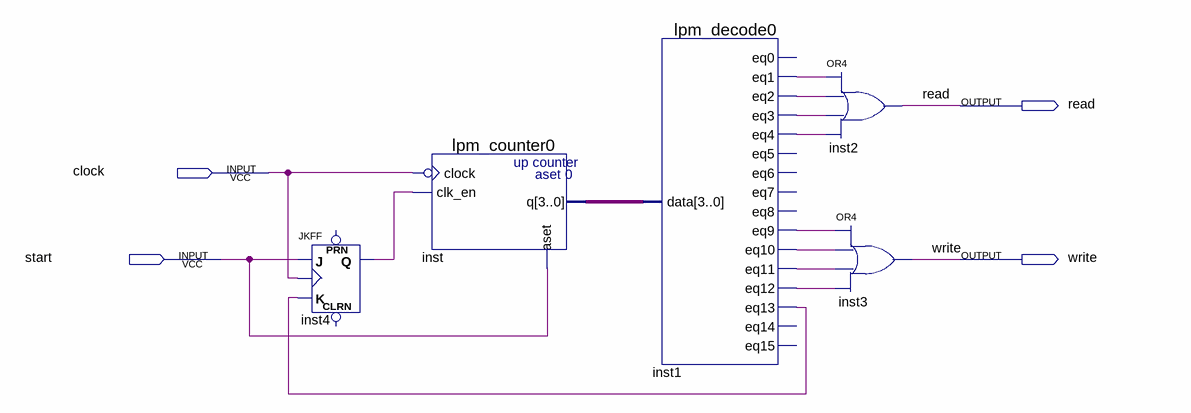
[diagram p0: schematic sheet]
// Quartus schematic tests.bdf as structural Verilog: 5 symbols, 4 pins
module tests (
  input  clock,
  input  start,
  output read,
  output write
);

  wire inst1_eq1, inst1_eq2, inst1_eq3, inst1_eq4, inst1_eq9, inst1_eq10, inst1_eq11, inst1_eq12, inst1_eq13,
       inst4_q;
  wire [3:0] inst_q;

  JKFF inst4 (.K(inst1_eq13), .J(start), .CLK(clock), .Q(inst4_q));  // open: PRN, CLRN
  lpm_counter0 inst (.clock(~clock), .clk_en(inst4_q), .aset(start), .q(inst_q));
  lpm_decode0 inst1 (
    .data(inst_q), .eq1(inst1_eq1), .eq2(inst1_eq2), .eq3(inst1_eq3), .eq4(inst1_eq4), .eq9(inst1_eq9),
    .eq10(inst1_eq10), .eq11(inst1_eq11), .eq12(inst1_eq12), .eq13(inst1_eq13));  // open: eq0, eq5, eq6, eq7, eq8, eq14, eq15
  or inst2 (read, inst1_eq1, inst1_eq2, inst1_eq3, inst1_eq4);
  or inst3 (write, inst1_eq9, inst1_eq10, inst1_eq11, inst1_eq12);
endmodule
